# EAGLE design H14R90 (EAGLE 9.6.2)

## Sheet 1 of 2
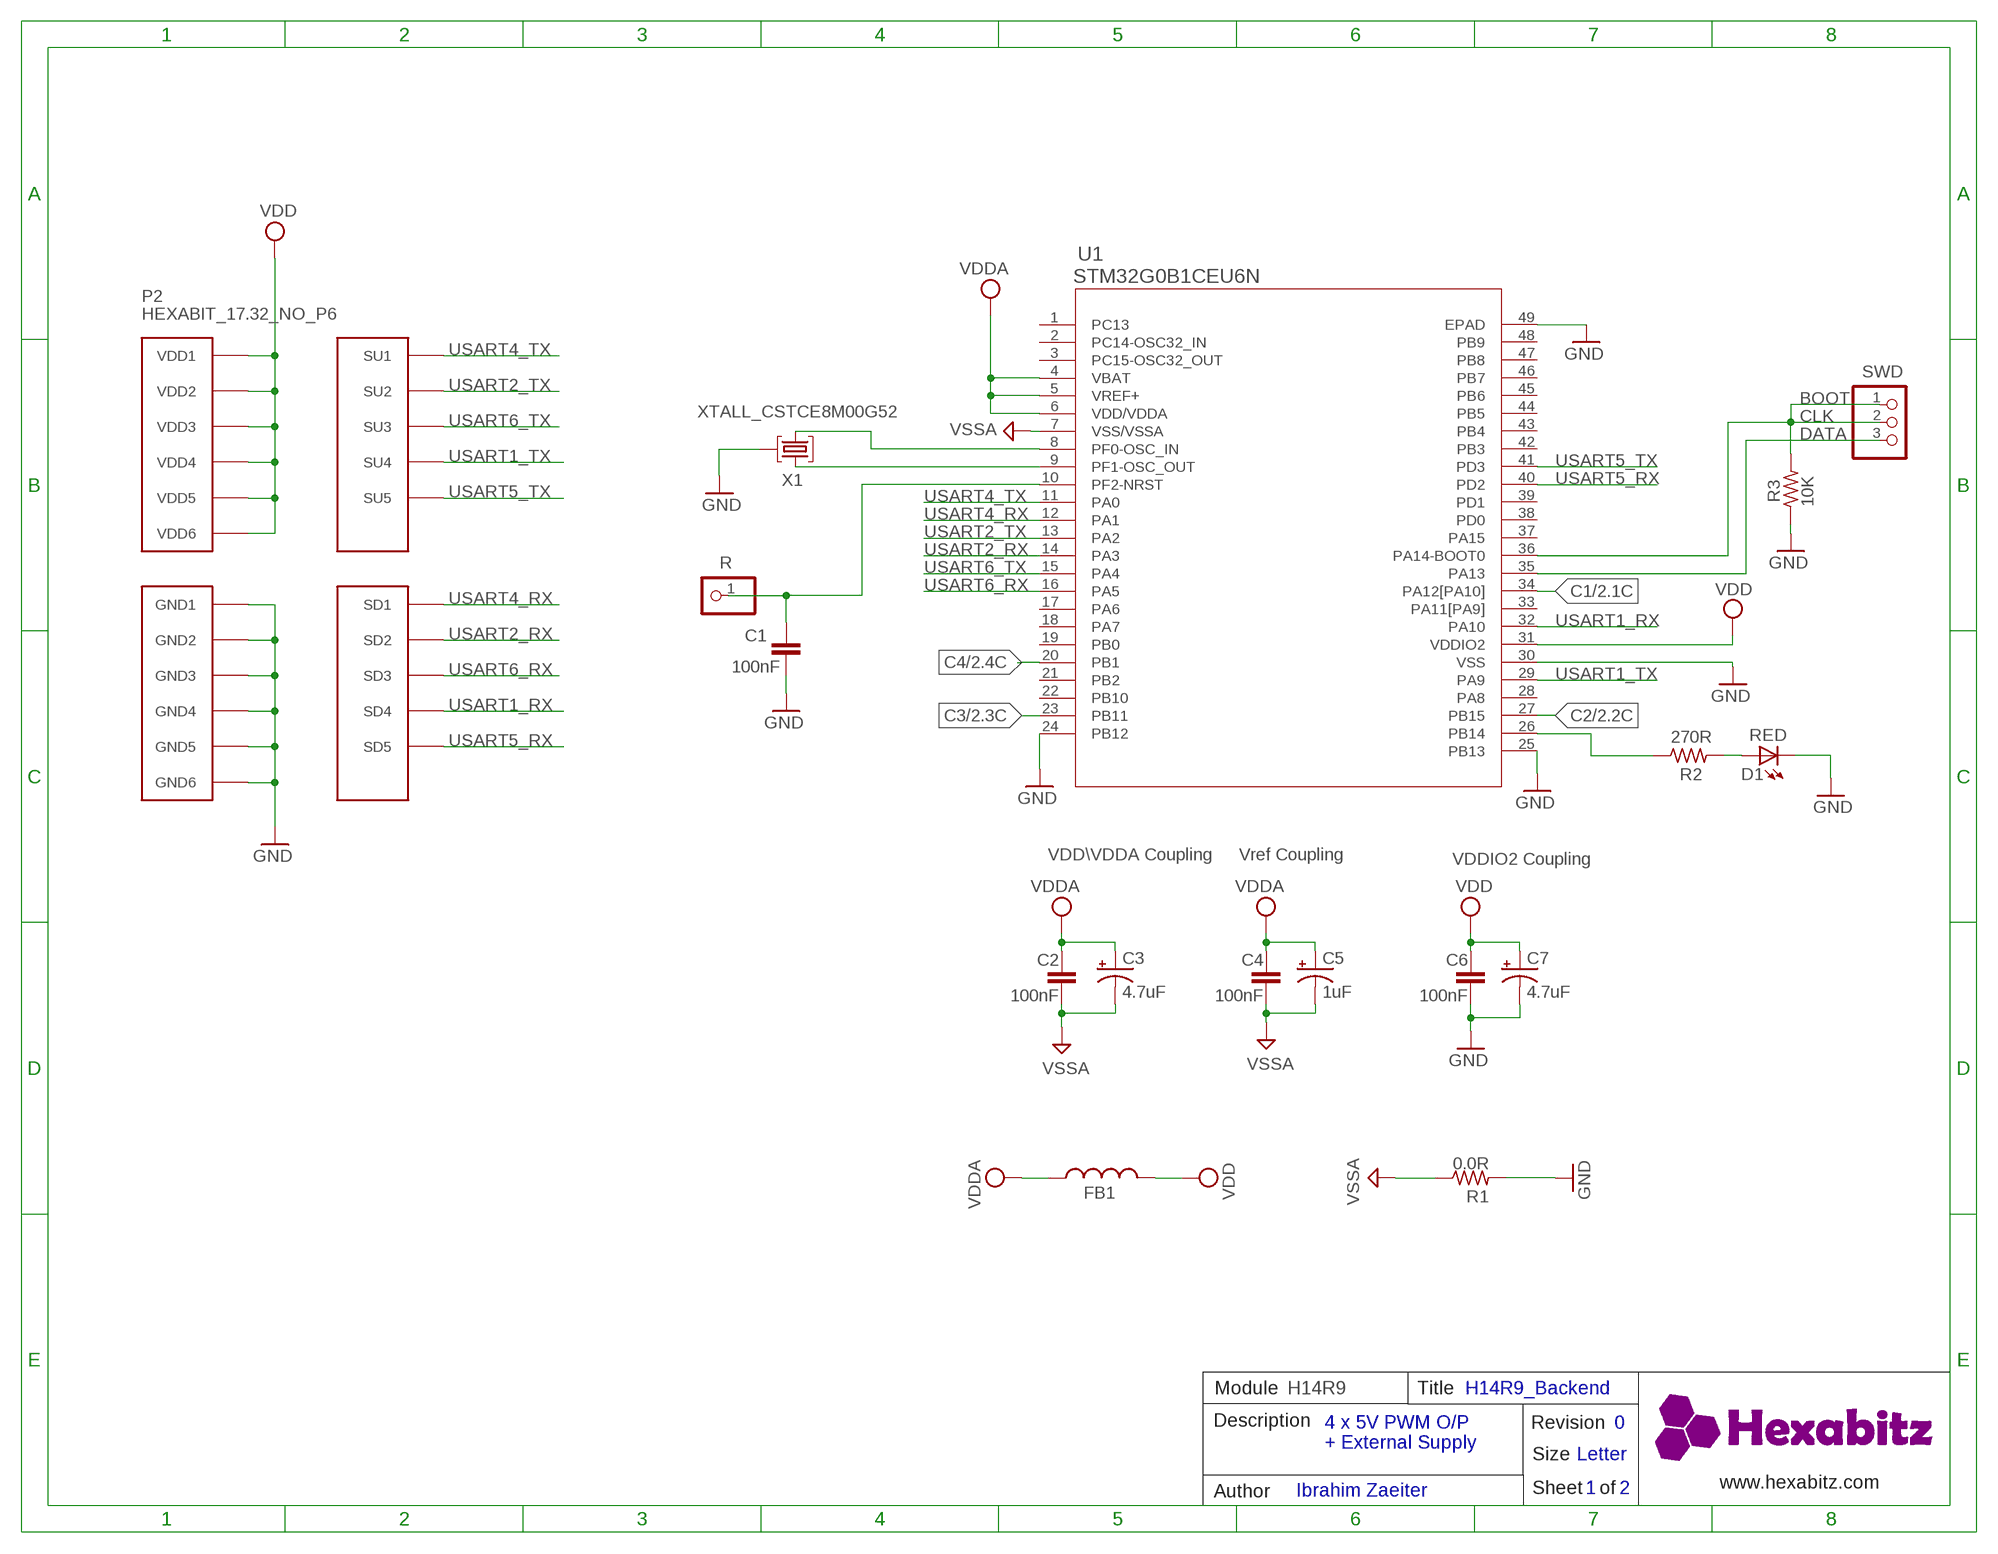
[diagram p0: schematic, sheet 1]

### Parts
C1  100nF  C-0603  [C-0603]
C2  100nF  C-0603  [C-0603]
C3  4.7uF  C-0805-POL  [C-0805-POL]
C4  100nF  C-0603  [C-0603]
C5  1uF  C-0805-POL  [C-0805-POL]
C6  100nF  C-0603  [C-0603]
C7  4.7uF  C-0805-POL  [C-0805-POL]
D1  RED  VLMS1300-GS08  [VLMS1300-GS08]
FB1  FB-0603  [FB-0603]
P2  HEXABIT_17.32_NO_P6  [HEXABIT_17.32_NO_P6]
R  R  PINHD-1X1  [1X01]
R1  0.0R  R-0603  [R-0603]
R2  270R  R-0603  [R-0603]
R3  10K  R-0603  [R-0603]
SWD  PINHD-1X3  [1X03]
U1  STM32G0B1CEU6N  [HEXABITZ_ICS_QFN_B1CEU6_STM-L]
X1  XTALL_CSTCE8M00G52  [XTALL_CSTCE8M00G52]

### Nets
C1: U1.34(PA12[PA10]) ; also sheet 2
C2: U1.27(PB15) ; also sheet 2
C3: U1.23(PB11) ; also sheet 2
C4: U1.20(PB1) ; also sheet 2
CLK: R3.2 SWD.1 SWD.2 U1.36(PA14-BOOT0)
DATA: SWD.3 U1.35(PA13)
GND: C1.2 C6.2 C7.2(-) D1.C P2.PAD_PD7(GND1) P2.PAD_PD8(GND2) P2.PAD_PD9(GND3) P2.PAD_PD10(GND4) P2.PAD_PD11(GND5) P2.PAD_PD12(GND6) R1.2 R3.1 U1.24(PB12) U1.25(PB13) U1.30(VSS) U1.49(EPAD) X1.P$2
N$1: D1.A R2.2
N$5: U1.9(PF1-OSC_OUT) X1.P$1
N$6: U1.8(PF0-OSC_IN) X1.P$3
N$8: C1.1 R.1 U1.10(PF2-NRST)
N$15: R2.1 U1.26(PB14)
USART1_RX: P2.PAD_PD4(SD4) U1.32(PA10)
USART1_TX: P2.PAD_PU4(SU4) U1.29(PA9)
USART2_RX: P2.PAD_PD2(SD2) U1.14(PA3)
USART2_TX: P2.PAD_PU2(SU2) U1.13(PA2)
USART4_RX: P2.PAD_PD1(SD1) U1.12(PA1)
USART4_TX: P2.PAD_PU1(SU1) U1.11(PA0)
USART5_RX: P2.PAD_PD5(SD5) U1.40(PD2)
USART5_TX: P2.PAD_PU5(SU5) U1.41(PD3)
USART6_RX: P2.PAD_PD3(SD3) U1.16(PA5)
USART6_TX: P2.PAD_PU3(SU3) U1.15(PA4)
VDD: C6.1 C7.1(+) FB1.2 P2.PAD_PU7(VDD1) P2.PAD_PU8(VDD2) P2.PAD_PU9(VDD3) P2.PAD_PU10(VDD4) P2.PAD_PU11(VDD5) P2.PAD_PU12(VDD6) U1.31(VDDIO2)
VDDA: C2.1 C3.1(+) C4.1 C5.1(+) FB1.1 U1.4(VBAT) U1.5(VREF+) U1.6(VDD/VDDA) ; also sheet 2
VSSA: C2.2 C3.2(-) C4.2 C5.2(-) R1.1 U1.7(VSS/VSSA) ; also sheet 2
Unconnected: U1.1(PC13) U1.2(PC14-OSC32_IN) U1.3(PC15-OSC32_OUT) U1.17(PA6) U1.18(PA7) U1.19(PB0) U1.21(PB2) U1.22(PB10) U1.28(PA8) U1.33(PA11[PA9]) U1.37(PA15) U1.38(PD0) U1.39(PD1) U1.42(PB3) U1.43(PB4) U1.44(PB5) U1.45(PB6) U1.46(PB7) U1.47(PB8) U1.48(PB9)

### Notes on the sheet
- BOOT
- VDD\VDDA Coupling | Vref Coupling | VDDIO2 Coupling
- Module | H14R9 | Title | H14R9_Backend
- Description | Revision | 0
- 4 x 5V PWM O/P 
  + External Supply
- Size | Letter
- www.hexabitz.com
- Author | Ibrahim Zaeiter | Sheet   of | 1 | 2
- C:/Users/Admin/Desktop/logodraft.bmp

## Sheet 2 of 2
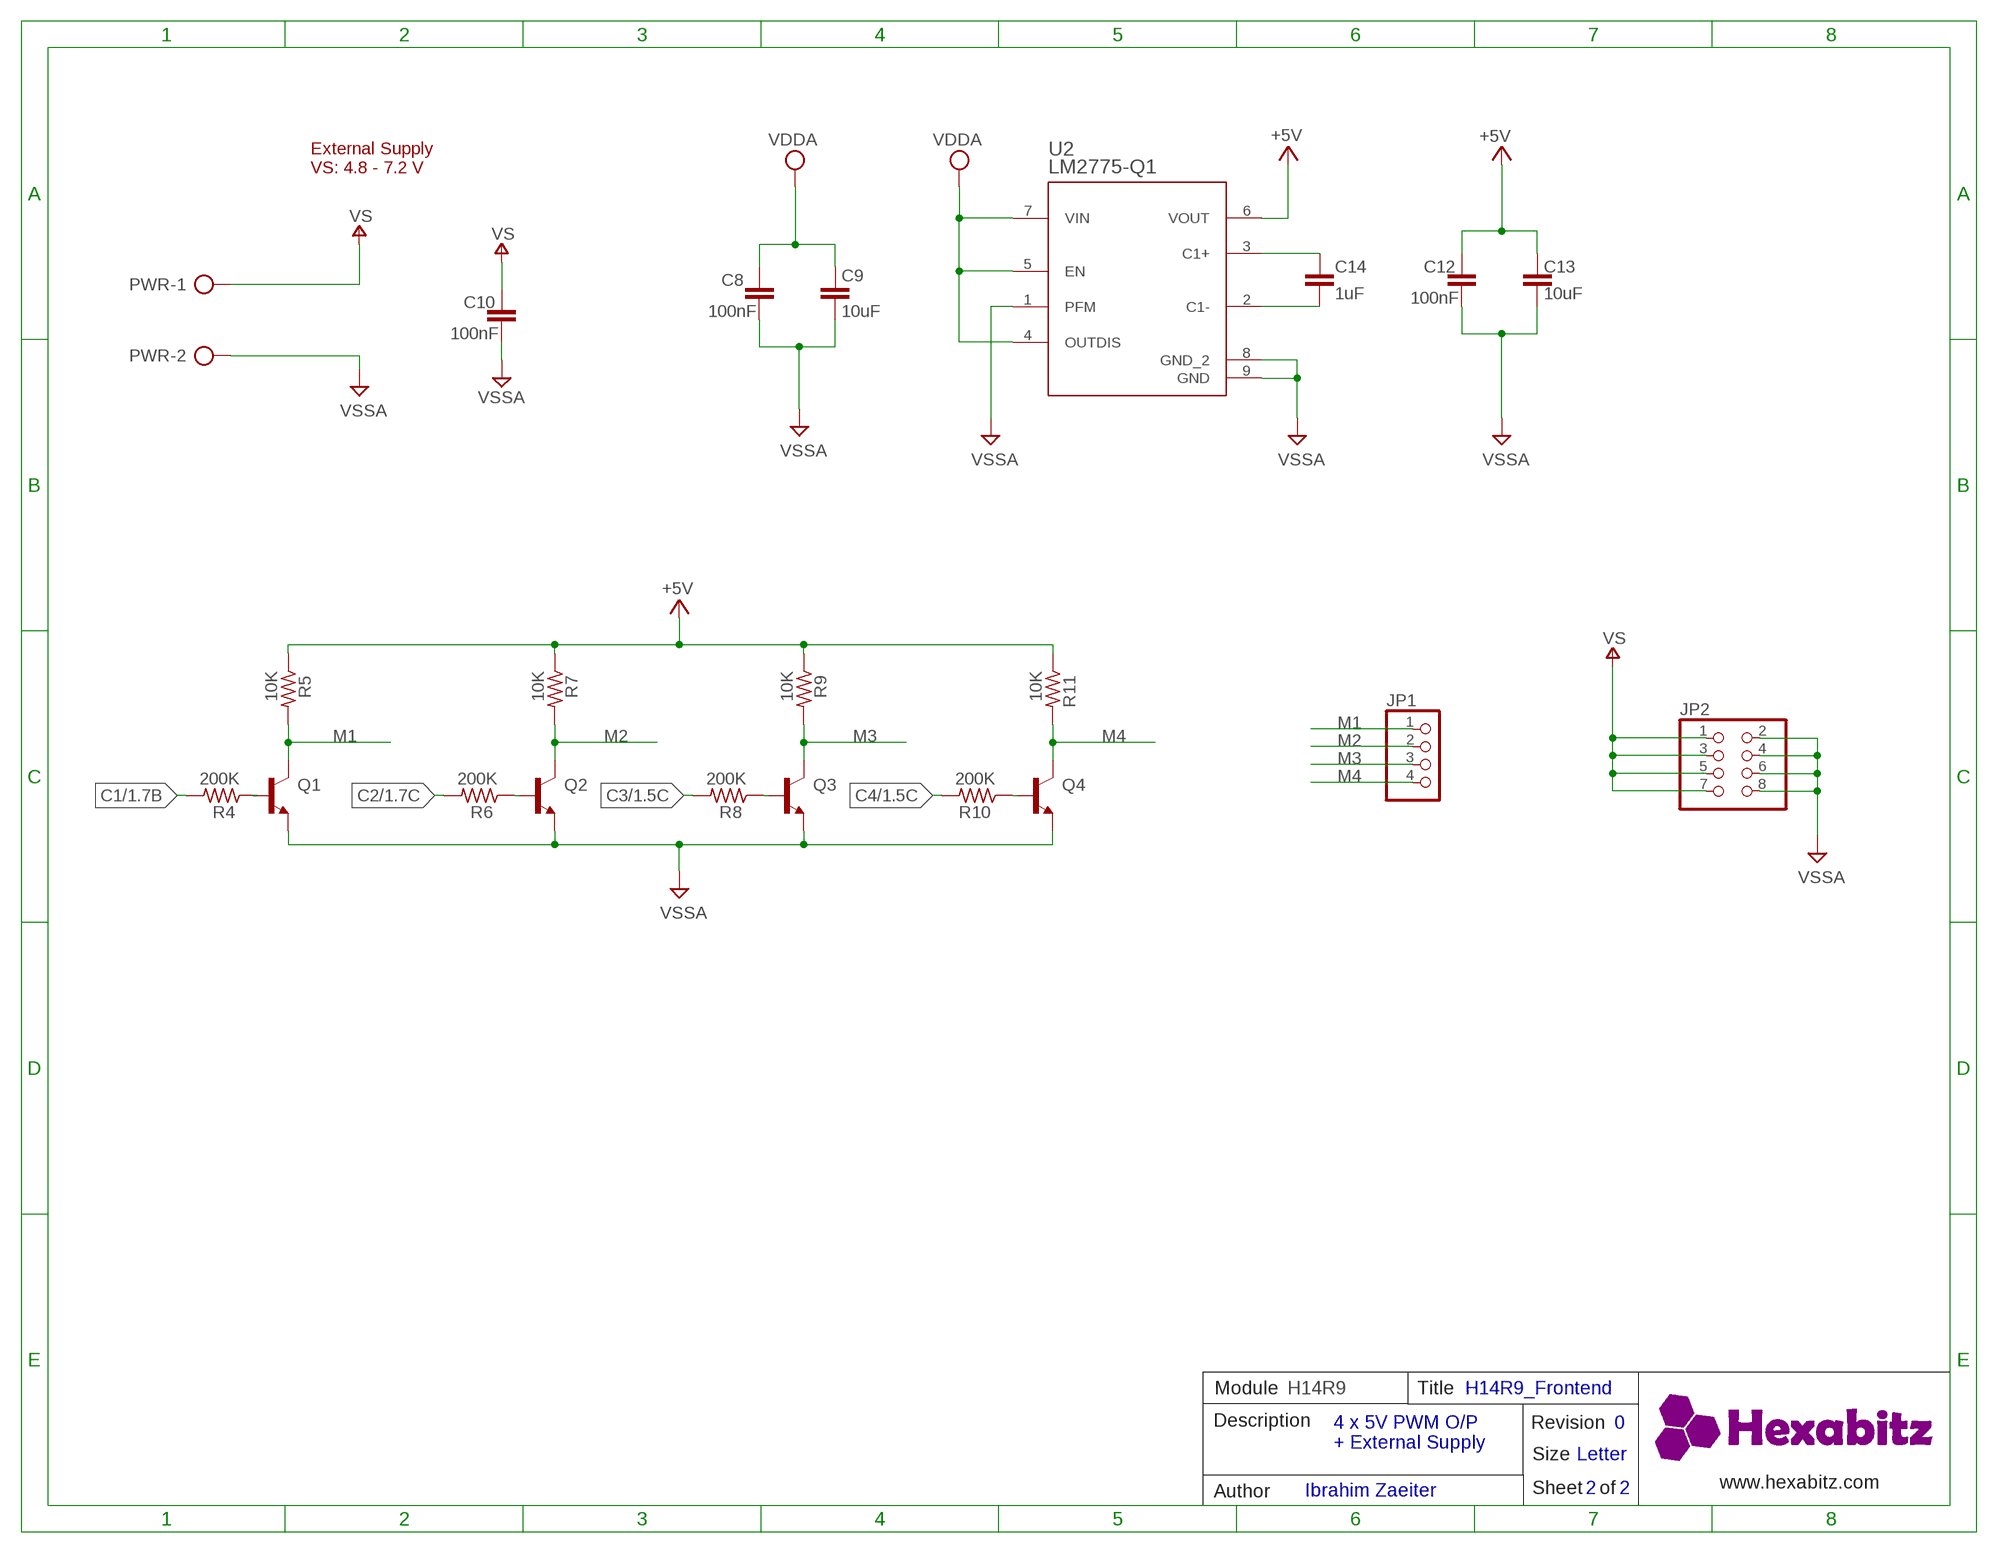
[diagram p1: schematic, sheet 2]

### Parts
C8  100nF  C-0603  [C-0603]
C9  10uF  C-0603  [C-0603]
C10  100nF  C-0603  [C-0603]
C12  100nF  C-0603  [C-0603]
C13  10uF  C-0603  [C-0603]
C14  1uF  C-0603  [C-0603]
JP1  PINHD-1X4  [1X04]
JP2  PINHD-2X4  [2X04]
PWR  AK500/2  [AK500/2]
Q1  MMBT3904LT1  [MMBT3904LT1]
Q2  MMBT3904LT1  [MMBT3904LT1]
Q3  MMBT3904LT1  [MMBT3904LT1]
Q4  MMBT3904LT1  [MMBT3904LT1]
R4  200K  R-0603  [R-0603]
R5  10K  R-0603  [R-0603]
R6  200K  R-0603  [R-0603]
R7  10K  R-0603  [R-0603]
R8  200K  R-0603  [R-0603]
R9  10K  R-0603  [R-0603]
R10  200K  R-0603  [R-0603]
R11  10K  R-0603  [R-0603]
U2  LM2775-Q1  LM2775QDSGRQ1  [DSG0008A]

### Nets
+5V: C12.1 C13.1 R5.1 R7.1 R9.1 R11.1 U2.6(VOUT)
C1: R4.2 ; also sheet 1
C2: R6.2 ; also sheet 1
C3: R8.2 ; also sheet 1
C4: R10.2 ; also sheet 1
M1: JP1.1 Q1.3(C) R5.2
M2: JP1.2 Q2.3(C) R7.2
M3: JP1.3 Q3.3(C) R9.2
M4: JP1.4 Q4.3(C) R11.2
N$3: C14.2 U2.2(C1-)
N$4: C14.1 U2.3(C1+)
N$7: Q1.1(B) R4.1
N$10: Q2.1(B) R6.1
N$12: Q3.1(B) R8.1
N$14: Q4.1(B) R10.1
V+: C10.1 JP2.1 JP2.3 JP2.5 JP2.7 PWR.1 ; supply symbol labelled VS
VDDA: C8.1 C9.1 U2.4(OUTDIS) U2.5(EN) U2.7(VIN) ; also sheet 1
VSSA: C8.2 C9.2 C10.2 C12.2 C13.2 JP2.2 JP2.4 JP2.6 JP2.8 PWR.2 Q1.2(E) Q2.2(E) Q3.2(E) Q4.2(E) U2.1(PFM) U2.8(GND_2) U2.9(GND) ; also sheet 1

### Notes on the sheet
- External Supply
  VS: 4.8 - 7.2 V
- Module | H14R9 | Title | H14R9_Frontend
- Description | Revision | 0
- 4 x 5V PWM O/P 
  + External Supply
- Size | Letter
- www.hexabitz.com
- Author | Ibrahim Zaeiter | Sheet   of | 2 | 2
- C:/Users/Admin/Desktop/logodraft.bmp

## Library data of the parts
C1 C2 C4 C6 C8-C10 C12-C14 = HEXABITZ_RCLS:C-0603: CAP CER 10% X7R 0603
C3 C5 C7 = HEXABITZ_RCLS:C-0805-POL: Cap Tant Solid SMD 2012
D1 = Hexabitz:VLMS1300-GS08: Red 0603 130° Clear 54 mcd 2 V Surface Mount ChipLED ; Octopart Url : http://octopart.com/vlms1300-gs08-vishay-21709201; MFN: Vishay; MPN: VLMS1300-GS08; OCTOPART_URL: https://octopart.com/vlms1300-gs08-vishay-21709201?r=sp&s=_gcP4_q8T1SC6PJQPTQ9yA
FB1 = HEXABITZ_RCLS:FB-0603: Ferrite Beads Multi-Layer 0603
JP1 = pinhead:PINHD-1X4: PIN HEADER
JP2 = pinhead:PINHD-2X4: PIN HEADER
P2 = hexabitz_connectors:HEXABIT_?_NO_P6: Hexabitz Hexagon Module Connector Hexagon side length = 17.32mm. The following ports are removed: P6
PWR = con-ptr500:AK500/2: CONNECTOR; OC_FARNELL: unknown; OC_NEWARK: unknown
Q1-Q4 = HEXABITZ_RCLS:MMBT3904LT1: TRANS NPN 40V 0.2A SOT23; MOUNTING_STYLE: Surface Mount; NUM_OF_PINS: 3; PACKAGE: SOT-23-3; PACKAGING: Reel; PRODUCT_CATEGORY: Transistors Bipolar-BJT; SERIES: MMBT3904L
R = HEXABITZ_USER_INTERFACE_PARTS:PINHD-1X1: PIN HEADER; MFN: TE Connectivity; MPN: 87227-1; OCTOPART_URL: https://octopart.com/87227-1-te+connectivity-39512052?r=sp
R1-R11 = HEXABITZ_RCLS:R-0603: Thick Film Resistors - SMD 0603
SWD = pinhead:PINHD-1X3: PIN HEADER
U1 = HEXABITZ_ICs:STM32G0B1CEU6N
U2 = HEXABITZ_ICs:LM2775QDSGRQ1: Switched Capacitor 5V Boost Converter 8-WSON -40 to 125; MANUFACTURER: Texas Instruments; MFN: Texas Instruments; MPN: LM2775QDSGRQ1; OCTOPART_URL: https://octopart.com/lm2775qdsgrq1-texas+instruments-93339195?r=sp&s=OA7oim0HQqaBsU4tLKFWXg LM2775QDSGRQ1; PARTNUMBER: LM2775QDSGRQ1; REFDES: RefDes; TYPE: TYPE
X1 = Hexabitz:XTALL_CSTCE8M00G52: MURATA CSTCE8M00G52-R0 RESONATOR, SMD, 8MHZ ; Octopart Url : https://octopart.com/cstce8m00g52-r0-murata-7145559; MFN: Murata; MPN: CSTCE8M00G52Z-R0; OCTOPART_URL: https://octopart.com/cstce8m00g52z-r0-murata-17755941?r=sp&s=JDnNJnrHQhyS8Zk4ofFWXw

## Board
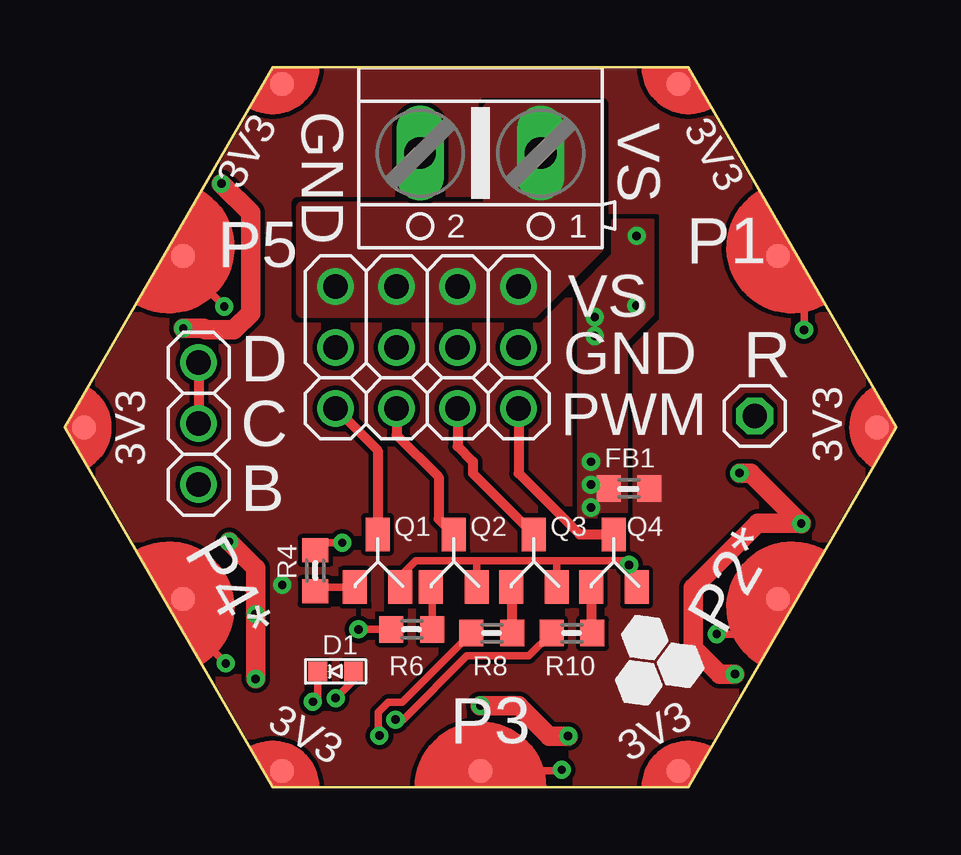
[diagram p2: board, top side]
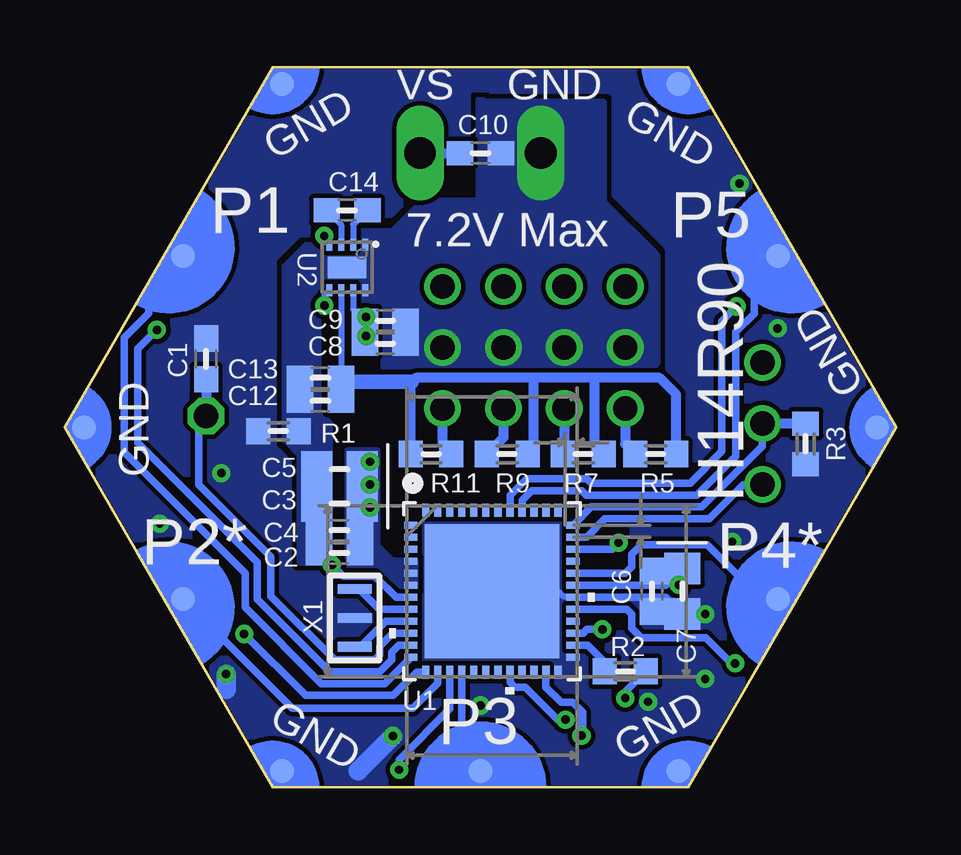
[diagram p3: board, bottom side, seen from below]

Size 34.64 x 30 mm. Coordinates in mm from the lower left corner, seen from the top.
Copper layers (1*16): Top 0.035mm / dielectric 1.5mm / Bottom 0.035mm
Design rules "default *": minimum track width 6mil, minimum drill 0.35mm, track to track 7.5mil, track to pad 7.5mil, pad to pad 7.5mil, via to via 7.5mil, smd to smd 0mil, copper to edge 1mil, drill to drill 6mil, minimum pad ring 10mil, minimum via ring 8mil, stop-mask expansion 4mil, vias tented up to drill 24mil, thermal gap 10mil

### Footprints (pad centres in the part's own frame; a part is rotated, then mirrored left to right if it is on the bottom)
C-0603 = smd 1.1 x 1: 1 -0.85,0; 2 0.85,0
C-0805-POL = smd 1.3 x 1.5: 1 -0.95,0; 2 0.95,0
VLMS1300-GS08 = smd 0.8 x 0.8: A 0,0.75; C 0,-0.75
FB-0603 = smd 1 x 1.1: 1 -0.85,0; 2 0.85,0
1X04 = drill 1.016: 1 -3.81,0; 2 -1.27,0; 3 1.27,0; 4 3.81,0
2X04 = drill 1.016: 1 -3.81,-1.27; 2 -3.81,1.27; 3 -1.27,-1.27; 4 -1.27,1.27; 5 1.27,-1.27; 6 1.27,1.27; 7 3.81,-1.27; 8 3.81,1.27
HEXABIT_17.32_NO_P6 = smd 1 x 1 bottom: PAD_PD1 12.39,7.15; PAD_PD2 12.39,-7.15; PAD_PD3 0,-14.31; PAD_PD4 -12.39,-7.15; PAD_PD5 -12.39,7.15; PAD_PD7 8.26,14.31; PAD_PD8 16.52,0; PAD_PD9 8.26,-14.31; PAD_PD10 -8.26,-14.31; PAD_PD11 -16.52,0; PAD_PD12 -8.26,14.31 | smd 1 x 1: PAD_PU1 12.39,7.15; PAD_PU2 12.39,-7.15; PAD_PU3 0,-14.31; PAD_PU4 -12.39,-7.15; PAD_PU5 -12.39,7.15; PAD_PU7 8.26,14.31; PAD_PU8 16.52,0; PAD_PU9 8.26,-14.31; PAD_PU10 -8.26,-14.31; PAD_PU11 -16.52,0; PAD_PU12 -8.26,14.31
AK500/2 = drill 1.321 long: 1 -2.515,0; 2 2.515,0
MMBT3904LT1 = smd 1 x 1.4: 1 -0.95,-1.1; 2 0.95,-1.1; 3 0,1.1
1X01 = drill 1.016 octagon: 1 0,0
R-0603 = smd 1 x 1.1: 1 -0.85,0; 2 0.85,0
1X03 = drill 1.016: 1 -2.54,0; 2 0,0; 3 2.54,0
HEXABITZ_ICS_QFN_B1CEU6_STM-L = smd 0.55 x 0.3: 1 -3.38,2.751; 2 -3.38,2.251; 3 -3.38,1.75; 4 -3.38,1.25; 5 -3.38,0.75; 6 -3.38,0.25; 7 -3.38,-0.25; 8 -3.38,-0.75; 9 -3.38,-1.25; 10 -3.38,-1.75; 11 -3.38,-2.251; 12 -3.38,-2.751; 25 3.38,-2.751; 26 3.38,-2.251; 27 3.38,-1.75; 28 3.38,-1.25; 29 3.38,-0.75; 30 3.38,-0.25; 31 3.38,0.25; 32 3.38,0.75; 33 3.38,1.25; 34 3.38,1.75; 35 3.38,2.251; 36 3.38,2.751 | smd 0.3 x 0.55: 13 -2.751,-3.38; 14 -2.251,-3.38; 15 -1.75,-3.38; 16 -1.25,-3.38; 17 -0.75,-3.38; 18 -0.25,-3.38; 19 0.25,-3.38; 20 0.75,-3.38; 21 1.25,-3.38; 22 1.75,-3.38; 23 2.251,-3.38; 24 2.751,-3.38; 37 2.751,3.38; 38 2.251,3.38; 39 1.75,3.38; 40 1.25,3.38; 41 0.75,3.38; 42 0.25,3.38; 43 -0.25,3.38; 44 -0.75,3.38; 45 -1.25,3.38; 46 -1.75,3.38; 47 -2.251,3.38; 48 -2.751,3.38 | smd 5.6 x 5.6: 49 0,0
DSG0008A = smd 0.5 x 0.25: 1 -0.95,0.75; 2 -0.95,0.25; 3 -0.95,-0.25; 4 -0.95,-0.75; 5 0.95,-0.75; 6 0.95,-0.25; 7 0.95,0.25; 8 0.95,0.75 | smd 0.9 x 1.6: 9 0,0
XTALL_CSTCE8M00G52 = smd 1.4 x 0.4: P$1 0,1.2; P$2 0,0; P$3 0,-1.2

### Placement (x,y rotation side)
C1  28.75,17.86 90 bottom
C2  23.19,9.76 180 bottom
C3  23.19,11.82 180 bottom
C4  23.19,10.71 180 bottom
C5  23.19,13.25 180 bottom
C6  10.18,8.17 270 bottom
C7  8.91,8.17 270 bottom
C8  21.29,19.45 0 bottom
C9  21.29,18.49 0 bottom
C10  17.32,26.43 0 bottom
C12  23.99,17.06 180 bottom
C13  23.99,16.11 180 bottom
C14  22.88,24.05 0 bottom
D1  11.29,4.84 270 top
FB1  23.51,12.46 0 top
JP1  15.1,15.79 0 top
JP2  15.1,19.6 180 top
P2  17.32,15 0 top
PWR  17.32,26.43 180 top
Q1  13.03,9.44 0 top
Q2  16.21,9.44 0 top
Q3  19.54,9.44 0 top
Q4  22.88,9.44 0 top
R  28.75,15.48 90 top
R1  25.73,14.84 180 bottom
R2  11.29,4.84 0 bottom
R3  3.77,14.31 90 bottom
R4  10.44,9.02 90 top
R5  10.02,13.89 180 bottom
R6  14.46,6.59 180 top
R7  13.03,13.89 180 bottom
R8  17.8,6.43 180 top
R9  16.21,13.89 180 bottom
R10  21.13,6.43 180 top
R11  19.38,13.89 0 bottom
SWD  5.57,15.16 270 top
U1  16.84,8.17 0 bottom
U2  22.88,21.67 270 bottom
X1  22.56,7.06 180 bottom

### Tracks (layer width: path | path; a pad name or v marks a point on that pad's centre or on a via)
+5V
  Bottom 0.254: U2.6 23.13,17.07 C12.1 23.14,16.75 C13.1
  Bottom 0.406: R5.1 9.17,16.37 9.86,17.06 12.56,17.06 | 12.56,17.06 15.1,17.06 | 15.1,17.06 20.02,17.06 20.18,16.9 20.23,16.85 R11.1 | R9.1 15.1,14.15 15.1,17.06 | R7.1 12.56,14.26 12.56,17.06
  Bottom 0.61: 20.18,16.9 22.98,16.9 23.14,16.75
C1  (via drill 0.35)
  Top 0.305: v11.56,10.19 10.76,10.19 R4.2
  Bottom 0.305: v11.56,10.19 11.83,9.92 U1.34
C2  (via drill 0.35)
  Top 0.305: R6.2 v12.24,6.59
  Bottom 0.305: v12.24,6.59 12.89,6.59 13.05,6.43 13.46,6.43 U1.27
C3  (via drill 0.35)
  Top 0.305: v13.11,2.16 13.11,2.48 13.06,2.53 13.06,3.12 13.48,3.55 14.07,3.55 R8.2
  Bottom 0.305: v13.11,2.16 13.11,2.48 13.06,2.53 13.06,3.12 13.48,3.55 13.96,3.55 14.6,4.18 14.6,4.79 U1.23
C4  (via drill 0.35)
  Top 0.305: v13.78,2.83 14.1,2.83 16.75,5.48 19.33,5.48 R10.2
  Bottom 0.305: v13.78,2.83 14.11,2.83 15.46,4.18 15.88,4.18 16.09,4.38 16.09,4.79 U1.20
CLK
  Top 0.406: SWD.1 SWD.2
  Bottom 0.305: SWD.2 5.57,14.21 8.09,11.69 12.7,11.69 U1.36
  Bottom 0.406: R3.2 SWD.2
DATA
  Bottom 0.305: U1.35 12.89,10.43 12.13,11.19 7.79,11.19 6.37,12.62 SWD.3
GND  (via drill 0.35)
  Top 0.305: D1.C 10.54,3.77 v10.34,3.57
  Top 0.813: v6.84,10.24 7.95,9.13 v7.95,7.22 v7.95,4.52 | v17.32,3.41 18.91,3.41 20.18,2.14 v20.97,2.14 | v4.94,19.13 5.79,19.13 5.86,19.06 7.05,19.06 7.74,19.76 7.74,23.95 v6.53,25.16 | v27.92,4.72 27.28,4.72 26.19,5.81 26.19,8.31 28.88,11 v30.68,11 v30.69,10.99 28.58,13.09 v28.12,13.09
  Bottom 0.254: U1.30 13.49,7.95 13.87,7.95 14.09,8.17 U1.49
  Bottom 0.305: 9.15,7.45 9.62,7.92 U1.30 | 9.15,7.45 9.08,7.38 | C6.2 9.28,7.32 9.15,7.45
  Bottom 0.406: C7.2 v7.96,7.22 v7.95,7.22
  Bottom 0.813: v20.97,2.14 22.42,0.69 | 33.84,14.58 P2.PAD_PD8 | v27.92,4.72 27.92,4.08
  pour Bottom (rank 3, no thermals): 8.59,29.92 25.89,29.92 34.62,15.16 26.05,0.08 8.59,0.08 0.02,15
M1
  Top 0.406: JP1.1 13.03,14.05 Q1.3
  Bottom 0.406: JP1.1 11.29,14.31 R5.2
M2
  Top 0.406: JP1.2 13.83,14.68 15.57,12.94 15.57,11.18 Q2.3
  Bottom 0.406: JP1.2 13.83,13.94 R7.2
M3
  Top 0.406: JP1.3 16.37,14.21 17,13.57 17,13.08 Q3.3
  Bottom 0.406: JP1.3 16.37,14.58 R9.2
M4
  Top 0.406: JP1.4 18.91,13.08 21.45,10.54 Q4.3
  Bottom 0.406: JP1.4 18.91,14.26 R11.2
N$1  (via drill 0.35)
  Top 0.305: v11.29,3.72 12.04,4.47 D1.A
  Bottom 0.305: R2.2 11.29,3.99 v11.29,3.72
N$3
  Bottom 0.254: C14.2 22.63,23.45 U2.2
N$4
  Bottom 0.254: C14.1 23.13,23.45 U2.3
N$5
  Bottom 0.305: U1.9 21.27,6.92 22.33,5.86 X1.P$1
N$6
  Bottom 0.305: X1.P$3 22.37,8.26 21.54,7.43 20.77,7.43 20.77,7.42 U1.8
N$7
  Top 0.305: R4.1 10.61,8.34 Q1.1
N$8
  Bottom 0.305: U1.10 20.98,6.42 21.52,5.88 21.52,5.52 21.72,5.32 23.4,5.32 26.05,7.97 26.05,9.6 29.07,12.62 29.07,15.16 R.1
  Bottom 0.406: C1.1 R.1
N$10
  Top 0.305: R6.1 15.31,8.28
  Top 0.406: Q2.1 15.31,8.28
N$12
  Top 0.406: R8.1 18.65,8.29 Q3.1
N$14
  Top 0.406: Q4.1 21.93,6.48 R10.1
N$15
  Bottom 0.305: U1.26 12.85,5.92 12.14,5.21 R2.1
USART1_RX
  Bottom 0.305: P2.PAD_PD4 5.61,7.85 7.87,10.12 10.62,10.12 11.02,9.72 11.02,9.19 11.29,8.92 U1.32
USART1_TX  (via drill 0.35)
  Top 0.305: v6.71,5.17 5.76,6.12 5.76,7.02 P2.PAD_PU4
  Bottom 0.305: v6.71,5.17 6.87,5.17 7.93,6.23 10.62,6.23 11.02,6.63 11.02,7.22 11.22,7.42 U1.29
USART2_RX
  Bottom 0.305: P2.PAD_PD2 25.16,3.3 20.13,3.3 19.09,4.34 U1.14
USART2_TX  (via drill 0.35)
  Top 0.305: v27.16,6.39 28.25,6.39 P2.PAD_PU2
  Bottom 0.305: U1.13 19.98,4.79 20.95,3.83 24.6,3.83 v27.16,6.39
USART4_RX
  Bottom 0.305: U1.12 21.31,4.33 23.95,4.33 27.12,7.5 27.12,8.93 32.16,13.96 32.16,18.73 31.13,19.76 31.13,20.62 30.98,20.87 P2.PAD_PD1
USART4_TX  (via drill 0.35)
  Top 0.305: v30.8,19.06 30.8,21.06 P2.PAD_PU1
  Bottom 0.305: U1.11 20.73,5.92 21.02,5.63 21.02,5.32 21.52,4.82 23.6,4.82 26.63,7.85 26.63,9.39 31.6,14.35 31.6,18.27 v30.8,19.06
USART5_RX
  Bottom 0.305: U1.40 15.59,11.97 15.19,12.36 13.1,12.36 12.92,12.18 8.3,12.18 6.68,13.8 6.68,18.99 5.92,19.74 5.92,21.16 P2.PAD_PD5
USART5_TX  (via drill 0.35)
  Top 0.305: P2.PAD_PU5 4.73,21.95 v6.64,20.04
  Bottom 0.305: U1.41 16.09,12.17 15.4,12.86 12.89,12.86 12.71,12.68 8.59,12.68 7.26,14.01 7.26,19.42 v6.64,20.04
USART6_RX
  Bottom 0.305: U1.16 18.09,1.46 P2.PAD_PD3
USART6_TX  (via drill 0.35)
  Top 0.305: v20.71,0.74 20.66,0.69 P2.PAD_PU3
  Bottom 0.305: v20.71,0.74 20.71,1.16 18.59,3.27 U1.15
V+
  Bottom 0.406: PWR.1 C10.1
  pour Top (no thermals): 17.64,28.34 22.24,28.34 22.24,22.46 19.54,19.76 9.86,19.76 9.86,24.21 17.64,24.21
VDD  (via drill 0.35)
  Bottom 0.305: U1.31 9.61,8.42 9.14,8.89 | 9.14,8.89 C7.1 | C6.1 9.28,9.02 9.14,8.89
  Bottom 0.406: C7.1 9.06,8.97 v9.06,8.44
  pour Top (rank 3, no thermals): 8.59,29.92 25.89,29.92 34.62,15.16 26.05,0.08 8.59,0.08 0.02,15
VDDA  (via drill 0.35)
  Top 0.406: FB1.1 22.5,12.62 v21.92,12.62
  Bottom 0.254: U2.7 22.63,19.93 C8.1 | C8.1 C9.1 | U2.5 23.82,20.52 v23.82,20.08 | U2.4 23.83,22.82 v23.83,22.98 | C8.1 22.08,19.5 v22.08,19.6
  other vias: 21.92,13.57 21.92,11.67 22.08,18.81
  pour Bottom (rank 2, no thermals): 22.88,14.05 22.88,9.29 22.24,8.65 21.77,8.65 21.45,8.33 20.02,8.33 20.02,9.44 20.97,9.44 21.61,10.08 21.61,14.05
  pour Top (rank 2, no thermals): 23.35,11.35 23.35,18.65 24.46,19.76 24.46,23.57 22.88,23.57 22.88,22.14 21.45,20.71 21.45,11.35
VSSA  (via drill 0.35)
  Top 0.254: Q4.2 23.51,8.66
  Top 0.305: 20.5,9.44 23.34,9.44 v23.51,9.27 23.51,8.66 | Q1.2 13.98,8.81 14.62,9.44 17.16,9.44 | 17.16,9.44 20.5,9.44 | Q3.2 20.49,9.44 20.5,9.44 | Q2.2 17.16,9.44
  Bottom 0.254: C2.2 23.56,9.27 v23.51,9.27
  Bottom 0.305: v23.51,9.27 23.04,8.81 21.72,8.81 20.84,7.92 U1.7
  pour Bottom (no thermals): 10.02,17.7 10.02,22.14 12.24,24.37 12.24,28.49 17.16,28.49 17.32,28.65 17.32,24.37 19.7,24.37 20.97,23.1 23.99,23.1 25.42,21.67 25.42,14.52 24.78,13.89 24.78,9.44 23.67,9.44 23.67,15.16 24.15,15.63 24.15,20.24 21.29,20.24 21.29,17.38 10.34,17.38

### Text on the board
tPlace: GND | VS | 3V3 | 3V3 | P5 | P1 | VS | D | GND | R | 3V3 | PWM | C | 3V3 | P4* | P2* | 3V3 | P3 | 3V3
bPlace: GND | VS | 7.2V Max | H14R90
tNames: B
bNames: GND | GND | P5 | P1 | GND | GND | P4* | P2* | P3 | GND | GND